# Altium schematic sheet Receiver.SchDoc
size B; SheetNumber: 2; SheetTotal: 8
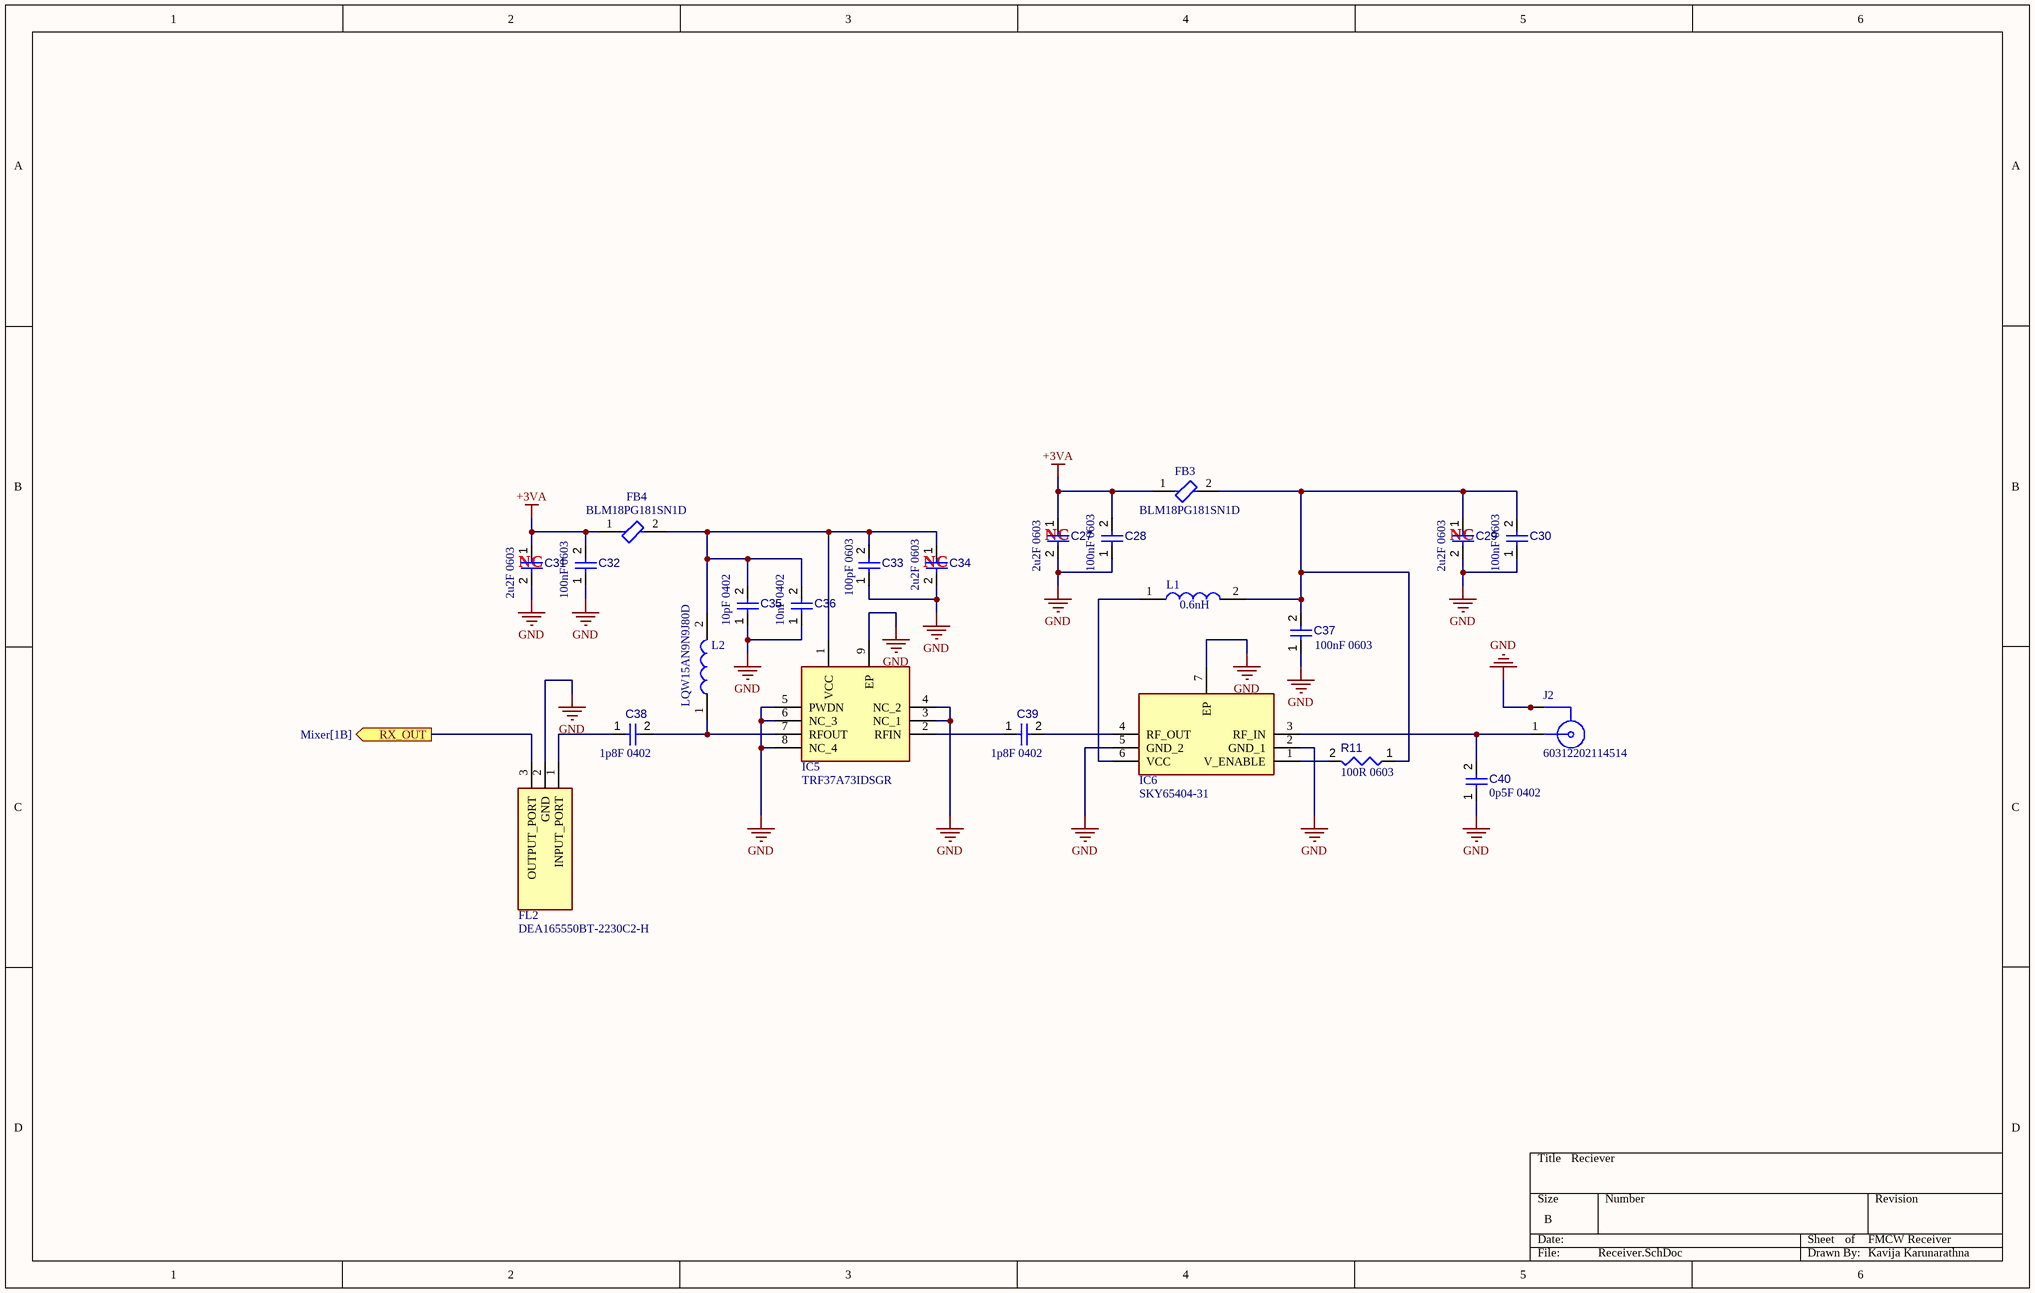
[diagram p0: Receiver.SchDoc]

## Parts
C27  value 2u2F 0603  [CAPC0603(1608)100_L]  (hidden comment: Capacitor 1µF +/-0.1% 25V 0603)
C28  value 100nF 0603  [CAPC0603(1608)100_L]  (hidden comment: Capacitor 1µF +/-0.1% 25V 0603)
C29  value 2u2F 0603  [CAPC0603(1608)100_L]  (hidden comment: Capacitor 1µF +/-0.1% 25V 0603)
C30  value 100nF 0603  [CAPC0603(1608)100_L]  (hidden comment: Capacitor 1µF +/-0.1% 25V 0603)
C31  value 2u2F 0603  [CAPC0603(1608)100_L]  (hidden comment: Capacitor 1µF +/-0.1% 25V 0603)
C32  value 100nF 0603  [CAPC0603(1608)100_L]  (hidden comment: Capacitor 1µF +/-0.1% 25V 0603)
C33  value 100pF 0603  [CAPC0603(1608)100_L]  (hidden comment: Capacitor 1µF +/-0.1% 25V 0603)
C34  value 2u2F 0603  [CAPC0603(1608)100_L]  (hidden comment: Capacitor 1µF +/-0.1% 25V 0603)
C35  value 10pF 0402  [CAPC0402(1005)60_L]  (hidden comment: Capacitor 47nF +/-20% 50V 0402)
C36  value 10nF 0402  [CAPC0402(1005)60_L]  (hidden comment: Capacitor 47nF +/-20% 50V 0402)
C37  value 100nF 0603  [CAPC0603(1608)100_L]  (hidden comment: Capacitor 1µF +/-0.1% 25V 0603)
C38  value 1p8F 0402  [CAPC0402(1005)60_L]  (hidden comment: Capacitor 47nF +/-20% 50V 0402)
C39  value 1p8F 0402  [CAPC0402(1005)60_L]  (hidden comment: Capacitor 47nF +/-20% 50V 0402)
C40  value 0p5F 0402  [CAPC0402(1005)60_L]  (hidden comment: Capacitor 220pF +/-10% 0402)
FB3  BLM18PG181SN1D  [FB-0603]
FB4  BLM18PG181SN1D  [FB-0603]
FL2  DEA165550BT-2230C2-H  [DEA165550BT-2230C2-H]
IC5  TRF37A73IDSGR  [SON50P200X200X80-9N]
IC6  SKY65404-31  [SON50P150X150X50-7N-D]
J2  60312202114514  [60312202114514]
L1  0.6nH  [LQP03HQ0N5B02D]
L2  LQW15AN9N9J80D  [LQW15AN10NG80D]
R11  value 100R 0603  [RESC0603(1608)_L]  (hidden comment: 120R3J)

## Ports
RX_OUT (out, see Mixer[1B])

## Nets
+3VA: C27.1 C28.2 C31.1 C32.2 FB3.1 FB4.1
GND: C27.2 C28.1 C29.2 C30.1 C31.2 C32.1 C33.1 C34.2 C35.1 C36.1 C37.1 C40.1 FL2.2(GND) IC5.3(NC_1) IC5.4(NC_2) IC5.5(PWDN) IC5.6(NC_3) IC5.8(NC_4) IC5.9(EP) IC6.2(GND_1) IC6.5(GND_2) IC6.7(EP) J2.2 J2.3 J2.4 J2.5
RX_OUT: FL2.3(OUTPUT_PORT) ; port RX_OUT
NetC29_1: C29.1 C30.2 C37.2 FB3.2 L1.2 R11.1
NetC33_2: C33.2 C34.1 C35.2 C36.2 FB4.2 IC5.1(VCC) L2.2
NetC38_1: C38.1 FL2.1(INPUT_PORT)
NetC38_2: C38.2 IC5.7(RFOUT) L2.1
NetC39_1: C39.1 IC5.2(RFIN)
NetC39_2: C39.2 IC6.4(RF_OUT)
NetC40_2: C40.2 IC6.3(RF_IN) J2.1
NetIC6_1: IC6.1(V_ENABLE) R11.2
NetIC6_6: IC6.6(VCC) L1.1

## Notes on the sheet
- (near C31) NC
- (near C34) NC
- (near C27) NC
- (near C29) NC
- Reciever
- FMCW Receiver
- Kavija Karunarathna

## Library data of the parts
C27 C29 C31 C34 = CMP-001-00055-4: Multilayer Ceramic Capacitors MLCC - SMD/SMT 0603 10nF 16volts X7R 10%; Manufacturer Part No: VJ0603G225KXQCW1BC; Tolerance: 20%; Min Operating Temperature: -55°C; Max Operating Temperature: 85°C; Voltage Rating: 25V; Mounting Technology: SMT; Case/Package: 0603; Pins: 2; Mouser Part No: 77-VJ0603G225KXQCWBC
C28 C30 C32 C37 = CMP-001-00055-4: Chip Capacitor, 1µF +/-0.1%, 25V, 0603, Thickness 1 mm; Manufacturer Part No: 0603X104K250CT; Tolerance: 20%; Min Operating Temperature: -55°C; Max Operating Temperature: 85°C; Voltage Rating: 25V; Mounting Technology: SMT; Case/Package: 0603; Pins: 2; Mouser Part No: 791-0603X104K250CT
C33 = CMP-001-00055-4: Chip Capacitor, 1µF +/-0.1%, 25V, 0603, Thickness 1 mm; Manufacturer Part No: 06033A101GAT2A; Tolerance: 20%; Min Operating Temperature: -55°C; Max Operating Temperature: 85°C; Voltage Rating: 25V; Mounting Technology: SMT; Case/Package: 0603; Pins: 2; Mouser Part No: 581-06033A101GAT2A
C35 = CMP-001-00071-4: Multilayer Ceramic Capacitors MLCC - SMD/SMT 50 V 10 pF C0G 0402 1%; Manufacturer Part No: CQ0402FRNPO9BN100; Tolerance: 20%; Pins: 2; Mounting Technology: SMT; Voltage Rating: 50V; Case/Package: 0402; Max Operating Temperature: 85°C; Min Operating Temperature: -55°C; Mouser Part No: 603-CQ0402FRNPO9BN10
C36 = CMP-001-00071-4: Multilayer Ceramic Capacitors MLCC - SMD/SMT 50 V 10 pF C0G 0402 1%; Manufacturer Part No: VJ0402Y103JXJAC; Tolerance: 20%; Pins: 2; Mounting Technology: SMT; Voltage Rating: 50V; Case/Package: 0402; Max Operating Temperature: 85°C; Min Operating Temperature: -55°C; Mouser Part No: 77-VJ0402Y103JXJAC
C38 C39 = CMP-001-00071-4: Multilayer Ceramic Capacitors MLCC - SMD/SMT 50 V 10 pF C0G 0402 1%; Manufacturer Part No: GJM1555C1H1R8CB01J; Tolerance: 20%; Pins: 2; Mounting Technology: SMT; Voltage Rating: 50V; Case/Package: 0402; Max Operating Temperature: 85°C; Min Operating Temperature: -55°C; Mouser Part No: 81-GJM1555C1H1R8CB1J
C40 = CMP-001-00071-4: Multilayer Ceramic Capacitors MLCC - SMD/SMT 50 V 10 pF C0G 0402 1%; Manufacturer Part No: 04025A0R5BAT4A; Voltage Rating: 50V; Tolerance: 20%; Pins: 2; Mounting Technology: SMT; Case/Package: 0402; Max Operating Temperature: 85°C; Min Operating Temperature: -55°C; Mouser Part No: 581-04025A0R5BAT4A
FB3 FB4 = 742792662-FB: FERRITE BEAD 0603; Max Current Rating: 2000mA; DC Resistance (DCR): 1000Ohm; Number of Lines: 1; Case/Package: 0603; Mount: Surface Mount; Case Code (Imperial): 0603; Packaging: Cut Tape; Max Operating Temperature: 125°C; Min Operating Temperature: -55°C; Manufacturer Part No: BLM18PG181SN1D; Mouser Part No: 81-BLM18PG181SN1D
FL2 = DEA165550BT-2230C2-H: Filter; Manufacturer_Name: TDK; Datasheet Link: https://product.tdk.com/system/files/dam/doc/product/rf/rf/filter/catalog/rf_bpf_dea165550bt-2322a1-h_en.pdf; Height: 0.65mm; Manufacturer Part No: DEA165550BT-2230C2-H; Mouser Price/Stock: https://www.mouser.co.uk/ProductDetail/TDK/DEA165550BT-2322A1-H?qs=t7xnP681wgVP2H2d%252Bwsz8A%3D%3D; Arrow Part Number: DEA165550BT-2322A1-H; Arrow Price/Stock: https://www.arrow.com/en/products/dea165550bt-2322a1-h/tdk?utm_currency=USD&region=nac; Mouser Part No: 810-DEA16555BT223C2H
IC5 = TRF37A73IDSGR: Integrated Circuit; Manufacturer_Name: Texas Instruments; Datasheet Link: https://www.ti.com/lit/gpn/trf37a73; Height: 0.8mm; Manufacturer Part No: TRF37A73IDSGR; Mouser Part No: 595-TRF37A73IDSGR; Mouser Price/Stock: https://www.mouser.co.uk/ProductDetail/Texas-Instruments/TRF37A73IDSGR?qs=7z%252BmIopC6%2FLSVnZOjS1Ggg%3D%3D; Arrow Part Number: TRF37A73IDSGR; Arrow Price/Stock: https://www.arrow.com/en/products/trf37a73idsgr/texas-instruments?utm_currency=USD&region=europe
IC6 = SKY65404-31: Integrated Circuit; Manufacturer_Name: Skyworks; Datasheet Link: https://labcenter.componentsearchengine.com/Datasheets/1/SKY65404-31.pdf; Height: 0.5mm; Manufacturer Part No: SKY65404-31; Mouser Part No: 873-SKY65404-31; Mouser Price/Stock: https://www.mouser.co.uk/ProductDetail/Skyworks-Solutions-Inc/SKY65404-31?qs=Qms%2F5q1u4ZO3Rpi9D7nTnA%3D%3D
J2 = CMP-381-000000-3: MF: {'manufacturer': u'W\xfcrth Elektronik'}; Package: None; Component Type: Standard; Pin Count: 5; Value: *; Availability: Unavailable; Design Item ID: 60312202114514; Price: None; Source: 60312202114514.SchLib; Mouser Part No: 710-60312202114514; Manufacturer Part No: 60312202114514
L1 = LQP03HQ0N6C02D: Inductor; Manufacturer_Name: Murata Electronics; Datasheet Link: https://search.murata.co.jp/Ceramy/image/img/P02/JELF243C-0021.pdf; Height: 0.42mm; Manufacturer Part No: LQP03HQ0N6C02D; Mouser Part No: 81-LQP03HQ0N6C02D
L2 = LQW15AN9N9J80D: Inductor; Manufacturer_Name: Murata Electronics; Datasheet Link: https://search.murata.co.jp/Ceramy/image/img/P02/JELF243A-0100.pdf; Height: 0.6mm; Manufacturer Part No: LQW15AN9N9J80D; Mouser Part No: 81-LQW15AN9N9J80D
R11 = CMP-009-00069-2: Thick Film Resistors - SMD WRIS-RSKS 100 Ohms 1 % 0.1 W 0603 AEC-Q200; Manufacturer Part No: 560112116009; Power: 100mW; Tolerance: 5%; Mounting Technology: SMT; Case/Package: 0603; Pins: 2; Mouser Part No: 710-560112116009